# Altium schematic sheet audio.SchDoc: Audio
size A4; Author: Sorgelig; Revision: 1.1; SheetNumber: 2; SheetTotal: 2
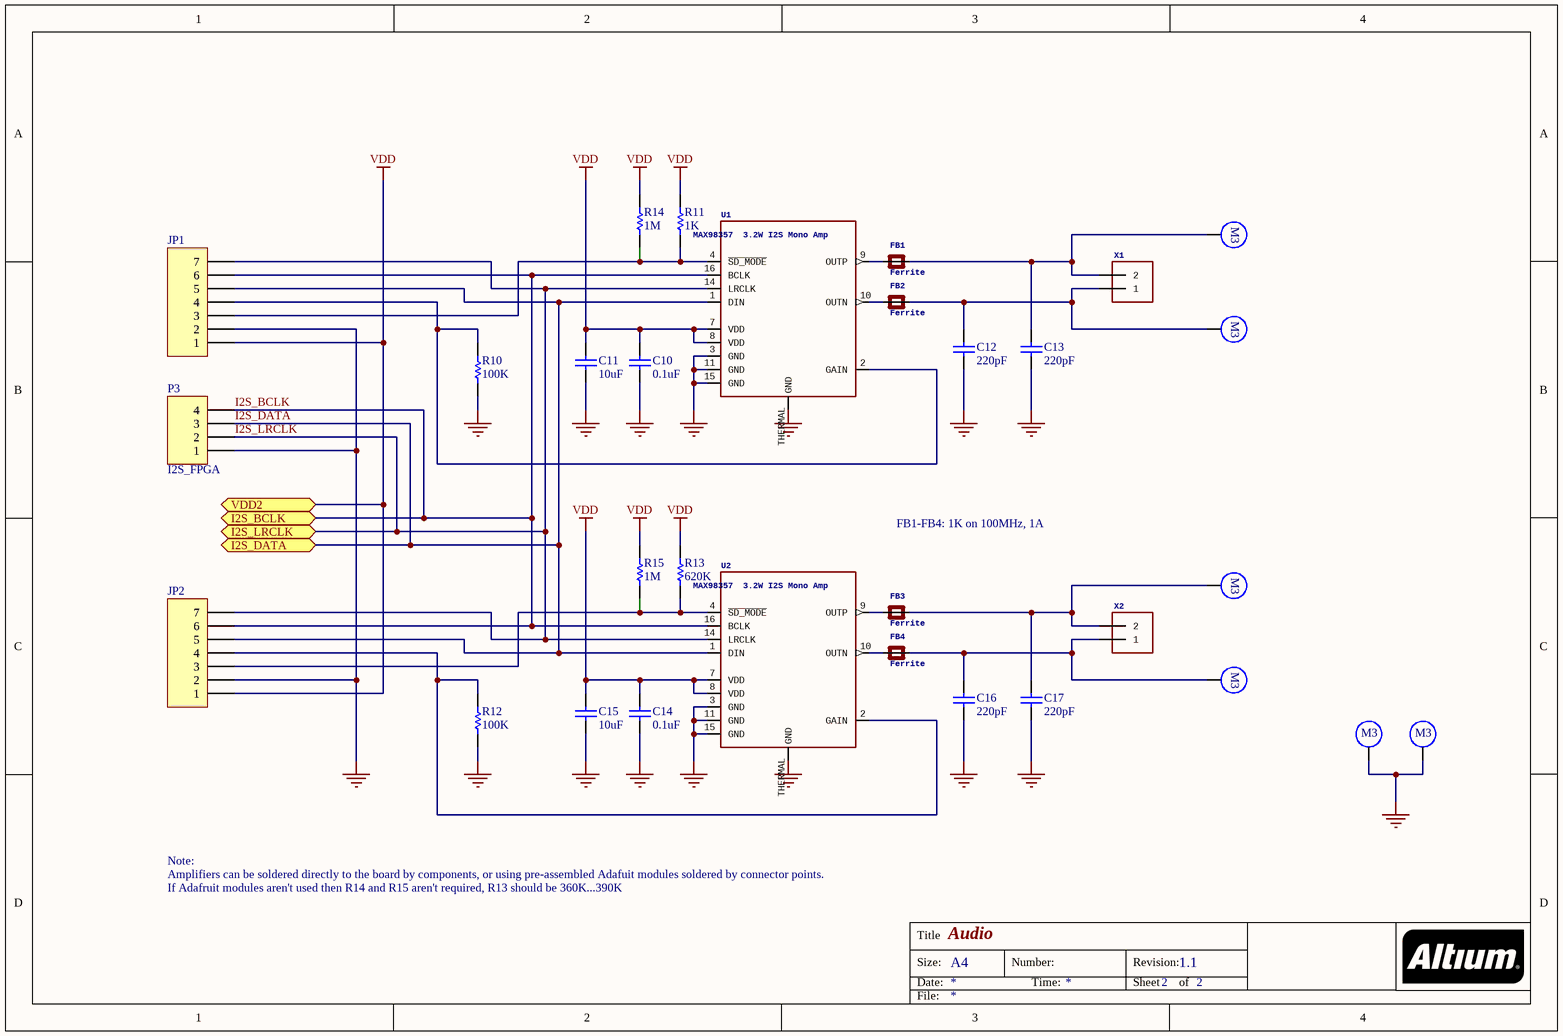
[diagram p0: audio.SchDoc]

## Parts
C10  value 0.1uF  [C0805]  (hidden comment: C0805)
C11  value 10uF  [C0805]  (hidden comment: C0805)
C12  value 220pF  [C0805]  (hidden comment: C0805)
C13  value 220pF  [C0805]  (hidden comment: C0805)
C14  value 0.1uF  [C0805]  (hidden comment: C0805)
C15  value 10uF  [C0805]  (hidden comment: C0805)
C16  value 220pF  [C0805]  (hidden comment: C0805)
C17  value 220pF  [C0805]  (hidden comment: C0805)
FB1  Ferrite  [FB0805]
FB2  Ferrite  [FB0805]
FB3  Ferrite  [FB0805]
FB4  Ferrite  [FB0805]
H11  M3  [M3]  (value not drawn)
H12  M3  [M3]  (value not drawn)
H13  M3  [M3]  (value not drawn)
H14  M3  [M3]  (value not drawn)
H15  M3  [M3]  (value not drawn)
H16  M3  [M3]  (value not drawn)
JP1  Header 7  [HDR1X7]  (value not drawn)
JP2  Header 7  [HDR1X7]  (value not drawn)
P3  I2S_FPGA  [HDR1X4]
R10  100K  [R0805]
R11  1K  [R0805]
R12  100K  [R0805]
R13  620K  [R0805]
R14  1M  [R0805]
R15  1M  [R0805]
U1  MAX98357
3.2WI2SMonoAmp: MAX98357 / 3.2W I2S Mono Amp  [QFN16_3MM]  (hidden comment: MAX98357A)
U2  MAX98357
3.2WI2SMonoAmp: MAX98357 / 3.2W I2S Mono Amp  [QFN16_3MM]  (hidden comment: MAX98357A)
X1  TERMBLOCK_1X2  [TERMBLOCK_1X2-3.5MM]  (value not drawn)
X2  TERMBLOCK_1X2  [TERMBLOCK_1X2-3.5MM]  (value not drawn)

## Ports
I2S_BCLK, I2S_DATA, I2S_LRCLK, VDD2

## Nets
GND: C10.1 C11.1 C12.1 C13.1 C14.1 C15.1 C16.1 C17.1 H15.1 H16.1 JP1.2 JP2.2 P3.1 R10.2 R12.2 U1.3(GND) U1.11(GND) U1.15(GND) U1.THERMAL(GND) U2.3(GND) U2.11(GND) U2.15(GND) U2.THERMAL(GND)
VDD: C10.2 C11.2 C14.2 C15.2 JP1.1 JP2.1 R11.1 R13.1 R14.1 R15.1 U1.7(VDD) U1.8(VDD) U2.7(VDD) U2.8(VDD) ; port VDD2
I2S_BCLK: JP1.6 JP2.6 P3.4 U1.16(BCLK) U2.16(BCLK) ; port I2S_BCLK
I2S_DATA: JP1.5 JP2.5 P3.3 U1.1(DIN) U2.1(DIN) ; port I2S_DATA
I2S_LRCLK: JP1.7 JP2.7 P3.2 U1.14(LRCLK) U2.14(LRCLK) ; port I2S_LRCLK
NetC12_2: C12.2 FB2.2(P$2) H12.1 X1.1
NetC13_2: C13.2 FB1.2(P$2) H11.1 X1.2
NetC16_2: C16.2 FB4.2(P$2) H14.1 X2.1
NetC17_2: C17.2 FB3.2(P$2) H13.1 X2.2
NetFB1_1: FB1.1(P$1) U1.9(OUTP)
NetFB2_1: FB2.1(P$1) U1.10(OUTN)
NetFB3_1: FB3.1(P$1) U2.9(OUTP)
NetFB4_1: FB4.1(P$1) U2.10(OUTN)
NetJP1_3: JP1.3 R11.2 R14.2 U1.4(~{SD_MODE})
NetJP1_4: JP1.4 R10.1 U1.2(GAIN)
NetJP2_3: JP2.3 R13.2 R15.2 U2.4(~{SD_MODE})
NetJP2_4: JP2.4 R12.1 U2.2(GAIN)

## Notes on the sheet
- FB1-FB4: 1K on 100MHz, 1A
- Note:
- Amplifiers can be soldered directly to the board by components, or using pre-assembled Adafuit modules soldered by connector points.
- If Adafruit modules aren't used then R14 and R15 aren't required, R13 should be 360K...390K
- Title
- Size:
- Date:
- A4
- Number:
- Time:
- Revision:
- Sheet
- of
- File:

## Library data of the parts
C10-C17 = C0805: Ceramic Chip Capacitor - Standard; Note: Footprint corresponds to dimensions for bulk cassette packaging. This case size has tightened tolerances.; Published: 17-Jul-2002; LatestRevisionDate: 19-Mar-2004; LatestRevisionNote: Silkscreen size reduced.; DatasheetDocument: Mar-2001; PackageDocument: Mar-2001; PackageReference: 0805; Publisher: Altium Limited; Code_JEITA: 0805; Code_IPC: 2012[0805]; ComponentLink1Description: Manufacturer Link; ComponentLink1URL: http://www.kemet.com/; ComponentLink2Description: Datasheet; ComponentLink2URL: http://www.kemet.com/kemet/web/homepage/kechome.nsf/vapubfilesname/F3102TA.pdf/$file/F3102TA.pdf
FB1-FB4 = FERRITE-0805NO: Ferrite Bead   0603 MMZ1608B121C - 120 Ohm @ 100MHz, 600mA, 0.15 Ohm DC Resistance - Digikey: 445-2164-1-ND  BK1608HW121-T - 120 Ohm, 600mA Ferrite Chip - Digikey: 587-1876-2-ND       0805 HZ0805B272R-10 - 2.7K Ohm @ 100MHz, 200mA, 0.8 Ohm DC Resistance - Digikey: 240-2504-1-ND (see also Murata BLM21BD272SN1L)  MMZ2012Y152B - 1.5K Ohm @ 100MHz, 500mA, 0.4 Ohm DC Resistance - Digikey: 445-1560-1-ND - Mainly for high frequency (80-400MHz)  MMZ2012R102A - 1K Ohm @ 100MHz, 500mA, 0.3 Ohm DC Resistance - Digikey: 445-1555-2-ND - More general purpose (10-200MHz)
JP1 JP2 = Header 7: Header, 7-Pin; LatestRevisionDate: 17-Jul-2002; LatestRevisionNote: Re-released for DXP Platform.; Publisher: Altium Limited
P3 = Header 4: Header, 4-Pin; LatestRevisionDate: 17-Jul-2002; LatestRevisionNote: Re-released for DXP Platform.; Publisher: Altium Limited
R10-R15 = ERJ6RS: Low Ohmic Value Thick Film Chip Resistor, 0.1 Ohm to 0.2 Ohm Range, 1%, 2% and 5% Tolerance, 0805 Size, 0.125 W; Published: 17-Dec-2003; LatestRevisionDate: 19-Mar-2004; LatestRevisionNote: Silkscreen size reduced.; PackageDocument: Mar-2003; PackageReference: 6-0805; Publisher: Altium Limited; Code_IPC: 2012 [0805]; ComponentLink1Description: Manufacturer Link; ComponentLink1URL: http://www.panasonic.com/industrial/components/resistive_products.htm; ComponentLink2Description: Datasheet; ComponentLink2URL: http://www.panasonic.com/industrial/components/pdf/AOA0000CE3.pdf
U1 U2 = MAX98357: MAX98357 - 3.2W I2S Mono Audio Amp; VDD:
Op.Temp: VDD: / Op. Temp:; 2.5-5.5V
-40~85В°C: 2.5-5.5V / -40~85В°C
X1 X2 = TERMBLOCK_1X2: 3.5mm Terminal block    http://www.ladyada.net/library/pcb/eaglelibrary.html